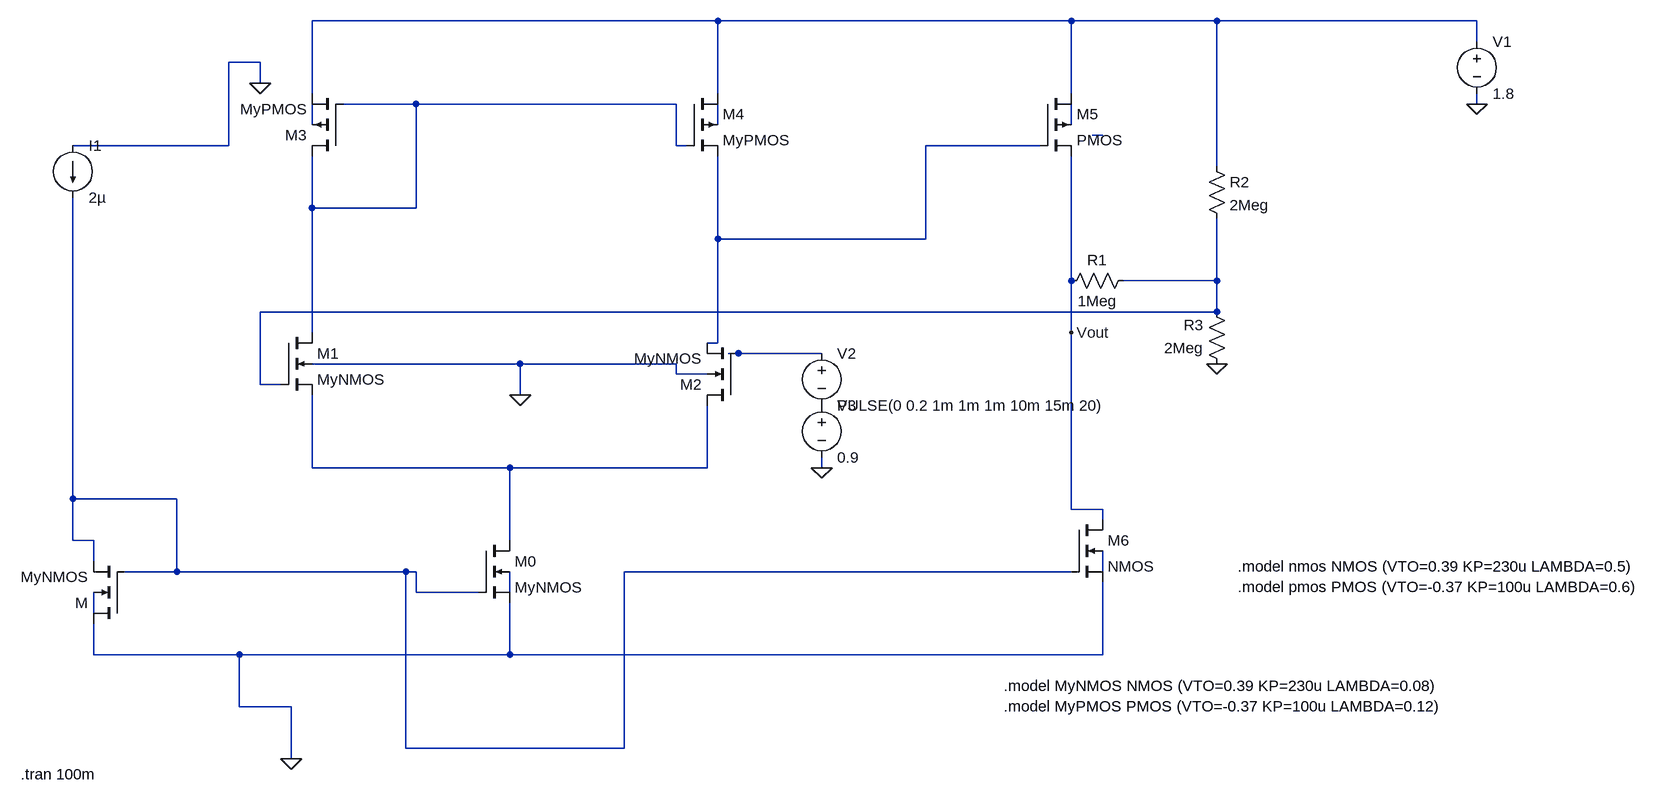
[diagram p0: schematic Close-loop.asc]
Close-loop.asc, the LTspice schematic file:
Version 4
SHEET 1 2412 776
WIRE 720 -704 96 -704
WIRE 1264 -704 720 -704
WIRE 1488 -704 1264 -704
WIRE 1888 -704 1488 -704
WIRE 1888 -672 1888 -704
WIRE 16 -640 -32 -640
WIRE 16 -608 16 -640
WIRE 96 -592 96 -704
WIRE 720 -592 720 -704
WIRE 1264 -592 1264 -704
WIRE 256 -576 144 -576
WIRE 656 -576 256 -576
WIRE 1888 -576 1888 -592
WIRE 96 -544 96 -576
WIRE 720 -544 720 -576
WIRE 1264 -544 1264 -576
WIRE 1312 -528 1296 -528
WIRE -32 -512 -32 -640
WIRE -32 -512 -272 -512
WIRE 656 -512 656 -576
WIRE 672 -512 656 -512
WIRE 1216 -512 1040 -512
WIRE 1488 -480 1488 -704
WIRE 96 -416 96 -496
WIRE 256 -416 256 -576
WIRE 256 -416 96 -416
WIRE 720 -368 720 -496
WIRE 1040 -368 1040 -512
WIRE 1040 -368 720 -368
WIRE 1264 -304 1264 -496
WIRE 1488 -304 1488 -400
WIRE 1488 -304 1344 -304
WIRE 1488 -256 1488 -304
WIRE 1488 -256 16 -256
WIRE 96 -224 96 -416
WIRE 1264 -224 1264 -304
WIRE 720 -208 720 -368
WIRE 720 -208 704 -208
WIRE 752 -192 736 -192
WIRE 880 -192 752 -192
WIRE 416 -176 96 -176
WIRE 656 -176 416 -176
WIRE 656 -160 656 -176
WIRE 704 -160 656 -160
WIRE 16 -144 16 -256
WIRE 48 -144 16 -144
WIRE 416 -128 416 -176
WIRE 96 -16 96 -128
WIRE 400 -16 96 -16
WIRE 704 -16 704 -112
WIRE 704 -16 400 -16
WIRE 880 -16 880 -32
WIRE -272 32 -272 -432
WIRE -112 32 -272 32
WIRE 1264 48 1264 -224
WIRE 1312 48 1264 48
WIRE 1312 64 1312 48
WIRE -272 96 -272 32
WIRE -240 96 -272 96
WIRE 400 96 400 -16
WIRE -240 128 -240 96
WIRE -112 144 -112 32
WIRE -112 144 -192 144
WIRE 240 144 -112 144
WIRE 256 144 240 144
WIRE 1264 144 576 144
WIRE 1312 144 1312 112
WIRE 256 176 256 144
WIRE 352 176 256 176
WIRE 400 176 400 144
WIRE -240 208 -240 176
WIRE -240 272 -240 224
WIRE -16 272 -240 272
WIRE 400 272 400 192
WIRE 400 272 -16 272
WIRE 1312 272 1312 160
WIRE 1312 272 400 272
WIRE -16 352 -16 272
WIRE 64 352 -16 352
WIRE 240 416 240 144
WIRE 576 416 576 144
WIRE 576 416 240 416
WIRE 64 432 64 352
FLAG 416 -128 0
FLAG 1888 -576 0
FLAG 16 -608 0
FLAG 64 432 0
FLAG 1488 -176 0
FLAG 1264 -224 Vout
FLAG 880 -16 0
SYMBOL nmos4 48 -224 R0
SYMATTR InstName M1
SYMATTR Value2 l=0.4u w=0.8696u
SYMATTR Value MyNMOS
SYMBOL nmos4 752 -112 R180
SYMATTR InstName M2
SYMATTR Value2 l=0.4u w=0.8696u
SYMATTR Value MyNMOS
SYMBOL nmos4 -192 224 R180
SYMATTR InstName M
SYMATTR Value2 l=0.5u w=60.375u
SYMATTR Value MyNMOS
SYMBOL pmos4 144 -496 R180
SYMATTR InstName M3
SYMATTR Value2 l=0.4u w=2u
SYMATTR Value MyPMOS
SYMBOL pmos4 672 -592 R0
SYMATTR InstName M4
SYMATTR Value2 l=0.4u w=2u
SYMATTR Value MyPMOS
SYMBOL nmos4 352 96 R0
SYMATTR InstName M0
SYMATTR Value2 l=0.8u w=966u
SYMATTR Value MyNMOS
SYMBOL current -272 -512 R0
WINDOW 123 0 0 Left 0
WINDOW 39 0 0 Left 0
SYMATTR InstName I1
SYMATTR Value 2µ
SYMBOL nmos4 1264 64 R0
SYMATTR InstName M6
SYMATTR Value2 l=0.5u w=210u
SYMBOL voltage 1888 -688 R0
WINDOW 123 0 0 Left 0
WINDOW 39 0 0 Left 0
SYMATTR InstName V1
SYMATTR Value 1.8
SYMBOL pmos4 1216 -592 R0
SYMATTR InstName M5
SYMATTR Value2 l=0.55u w=1.9u
SYMBOL res 1360 -320 R90
WINDOW 0 0 56 VBottom 2
WINDOW 3 32 56 VTop 2
SYMATTR InstName R1
SYMATTR Value 1Meg
SYMBOL res 1504 -160 R180
WINDOW 0 36 76 Left 2
WINDOW 3 36 40 Left 2
SYMATTR InstName R3
SYMATTR Value 2Meg
SYMBOL voltage 880 -208 R0
WINDOW 123 0 0 Left 0
WINDOW 39 0 0 Left 0
SYMATTR InstName V2
SYMATTR Value PULSE(0 0.2 1m 1m 1m 10m 15m 20)
SYMBOL res 1472 -496 R0
SYMATTR InstName R2
SYMATTR Value 2Meg
SYMBOL voltage 880 -128 R0
WINDOW 123 0 0 Left 0
WINDOW 39 0 0 Left 0
SYMATTR InstName V3
SYMATTR Value 0.9
TEXT 1160 320 Left 2 !.model MyNMOS NMOS (VTO=0.39 KP=230u LAMBDA=0.08)\n.model MyPMOS PMOS (VTO=-0.37 KP=100u LAMBDA=0.12)
TEXT 1520 136 Left 2 !.model nmos NMOS (VTO=0.39 KP=230u LAMBDA=0.5)\n.model pmos PMOS (VTO=-0.37 KP=100u LAMBDA=0.6)
TEXT -352 456 Left 2 !.tran 100m

The netlist it stands for:
* Close-loop.asc
M1 N002 N008 N010 0 MyNMOS l=0.4u w=0.8696u
M2 N010 N009 N007 0 MyNMOS l=0.4u w=0.8696u
M 0 N011 N011 N014 MyNMOS l=0.5u w=60.375u
M3 N002 N002 N001 N003 MyPMOS l=0.4u w=2u
M4 N001 N002 N007 N004 MyPMOS l=0.4u w=2u
M0 N010 N011 0 N013 MyNMOS l=0.8u w=966u
I1 0 N011 2µ
M6 Vout N011 0 N012 NMOS l=0.5u w=210u
V1 N001 0 1.8
M5 N001 N007 Vout N005 PMOS l=0.55u w=1.9u
R1 N008 Vout 1Meg
R3 0 N008 2Meg
V2 N009 P001 PULSE(0 0.2 1m 1m 1m 10m 15m 20)
R2 N001 N008 2Meg
V3 P001 0 0.9
.model NMOS NMOS
.model PMOS PMOS
.lib standard.mos
.model MyNMOS NMOS (VTO=0.39 KP=230u LAMBDA=0.08)
.model MyPMOS PMOS (VTO=-0.37 KP=100u LAMBDA=0.12)
.model nmos NMOS (VTO=0.39 KP=230u LAMBDA=0.5)
.model pmos PMOS (VTO=-0.37 KP=100u LAMBDA=0.6)
.tran 100m
.backanno
.end